# EAGLE design mapleCUx_large_330-007 (EAGLE 7.6.0)
MAPLE-CUx Large Version
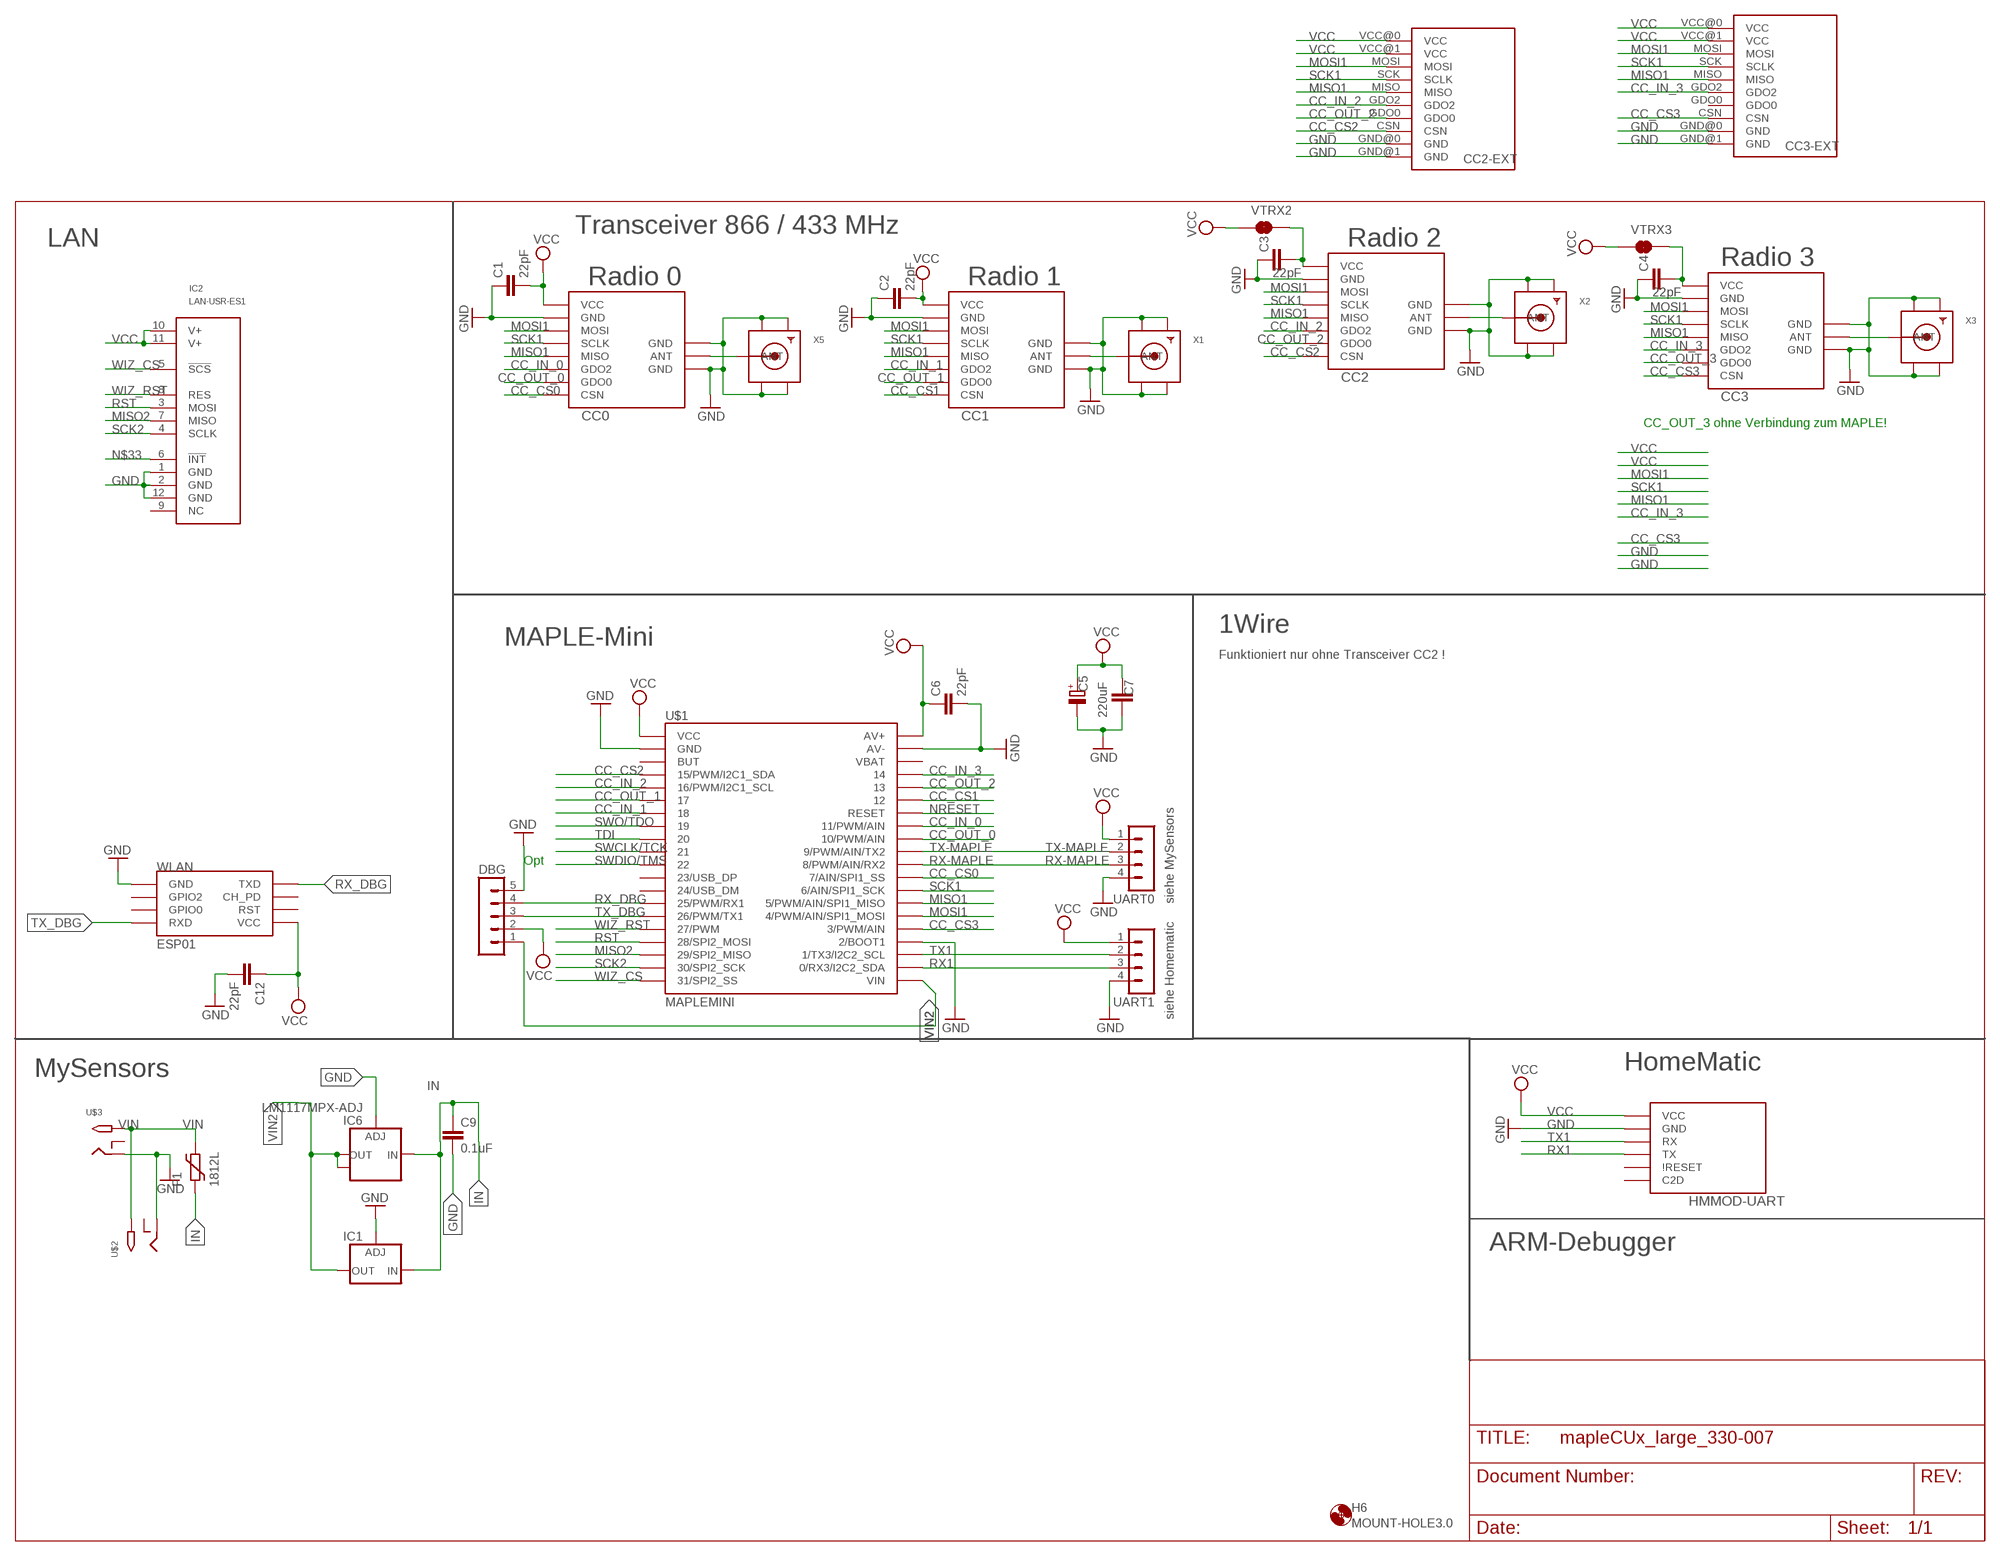
[diagram p0: schematic, sheet 1]

## Parts
C1  22pF  C-EUC0805  [C0805]
C2  22pF  C-EUC0805  [C0805]
C3  22pF  C-EUC0805  [C0805]
C4  22pF  C-EUC0805  [C0805]
C5  220uF  CPOL-EUE5-8.5  [E5-8,5]
C6  22pF  C-EUC0805  [C0805]
C7  C-EUC1812  [C1812]
C9  0.1uF  C-EUC1206  [C1206]
C12  22pF  C-EUC0805  [C0805]
CC0  CC1101  CC1101_MODULE1SMD  [CC1101_MODULE1_SMD]
CC1  CC1101_MODULE1SMD  [CC1101_MODULE1_SMD]
CC2  CC1101_MODULE1SMD  [CC1101_MODULE1_SMD]
CC2-EXT  CC1101_MODULE3_DIL  [CC1101_MODULE3_DIL]
CC3  CC1101_MODULE1SMD  [CC1101_MODULE1_SMD]
CC3-EXT  CC1101_MODULE3_DIL  [CC1101_MODULE3_DIL]
DBG  MA05-1  [MA05-1]
F1  1812L  [1812L]
H6  MOUNT-HOLE3.0  [3,0]
HMMOD-UART  HM-MOD-UARTDIL  [HM-MOD-UART-DIL]
IC1  LD117ADT50TR  [DPACK]
IC2  LAN-USR-ES1  [USR-ES1]
IC6  LM1117MPX-ADJ  [SOT223]
U$1  MAPLEMINI  [20-DIP]
U$2  2.1MMJACKTHM  [PJ-102A]
U$3  2.1MMJACKTHM  [PJ-102A]
UART0  MA04-1  [MA04-1]
UART1  MA04-1  [MA04-1]
VTRX2  JUMPER-SMT_2_NC_TRACE_SILK  [SMT-JUMPER_2_NC_TRACE_SILK]
VTRX3  JUMPER-SMT_2_NC_TRACE_SILK  [SMT-JUMPER_2_NC_TRACE_SILK]
WLAN  ESP01  [ESP01]
X1  SMACONNECTOR_EDGE  [SMA_EDGELAUNCH]
X2  SMACONNECTOR_EDGE  [SMA_EDGELAUNCH]
X3  SMACONNECTOR_EDGE  [SMA_EDGELAUNCH]
X5  SMACONNECTOR_EDGE  [SMA_EDGELAUNCH]

## Nets
ANT0: CC0.ANT X5.P(ANT)
ANT1: CC1.ANT X1.P(ANT)
ANT2: CC2.ANT X2.P(ANT)
ANT3: CC3.ANT X3.P(ANT)
CC_CS0: CC0.CSN U$1.29(7/AIN/SPI1_SS)
CC_CS1: CC1.CSN U$1.35
CC_CS2: CC2-EXT.CSN CC2.CSN U$1.4(15/PWM/I2C1_SDA)
CC_CS3: CC3-EXT.CSN CC3.CSN U$1.25(3/PWM/AIN)
CC_IN_0: CC0.GDO2 U$1.33(11/PWM/AIN)
CC_IN_1: CC1.GDO2 U$1.7
CC_IN_2: CC2-EXT.GDO2 CC2.GDO2 U$1.5(16/PWM/I2C1_SCL)
CC_IN_3: CC3-EXT.GDO2 CC3.GDO2 U$1.37
CC_OUT_0: CC0.GDO0 U$1.32(10/PWM/AIN)
CC_OUT_1: CC1.GDO0 U$1.6
CC_OUT_2: CC2-EXT.GDO0 CC2.GDO0 U$1.36
CC_OUT_3: CC3.GDO0
GND [Power]: C1.1 C2.1 C3.1 C4.1 C5.- C6.2 C7.1 C9.2 C12.2 CC0.GND@0(GND) CC0.GND@1(GND) CC0.GND@2(GND) CC1.GND@0(GND) CC1.GND@1(GND) CC1.GND@2(GND) CC2-EXT.GND@0(GND) CC2-EXT.GND@1(GND) CC2.GND@0(GND) CC2.GND@1(GND) CC2.GND@2(GND) CC3-EXT.GND@0(GND) CC3-EXT.GND@1(GND) CC3.GND@0(GND) CC3.GND@1(GND) CC3.GND@2(GND) DBG.5 HMMOD-UART.2(GND) IC1.1(ADJ) IC2.1(GND) IC2.2(GND) IC2.12(GND) IC6.1(ADJ) U$1.2(GND) U$1.24(2/BOOT1) U$1.39(AV-) U$2.RING U$3.RING UART0.4 UART1.4 WLAN.GND X1.GND@1(GND4) X1.GND@2(GND3) X1.GND@3(GND2) X1.GND@4(GND1) X2.GND@1(GND4) X2.GND@2(GND3) X2.GND@3(GND2) X2.GND@4(GND1) X3.GND@1(GND4) X3.GND@2(GND3) X3.GND@3(GND2) X3.GND@4(GND1) X5.GND@1(GND4) X5.GND@2(GND3) X5.GND@3(GND2) X5.GND@4(GND1)
IN [Power]: C9.1 F1.P$1 IC1.3(IN) IC6.3(IN)
MISO1: CC0.MISO CC1.MISO CC2-EXT.MISO CC2.MISO CC3-EXT.MISO CC3.MISO U$1.27(5/PWM/AIN/SPI1_MISO)
MISO2: IC2.7(MISO) U$1.18(29/SPI2_MISO)
MOSI1: CC0.MOSI CC1.MOSI CC2-EXT.MOSI CC2.MOSI CC3-EXT.MOSI CC3.MOSI U$1.26(4/PWM/AIN/SPI1_MOSI)
N$1 [Power]: C3.2 CC2.VCC VTRX2.2
N$3 [Power]: C4.2 CC3.VCC VTRX3.2
N$33: IC2.6(!INT!)
NRESET: U$1.34(RESET)
RST: IC2.3(MOSI) U$1.17(28/SPI2_MOSI)
RX1: HMMOD-UART.5(TX) U$1.22(0/RX3/I2C2_SDA) UART1.3
RX-MAPLE: U$1.30(8/PWM/AIN/RX2) UART0.3
RX_DBG: DBG.4 U$1.14(25/PWM/RX1) WLAN.TX(TXD)
SCK1: CC0.SCLK CC1.SCLK CC2-EXT.SCK(SCLK) CC2.SCLK CC3-EXT.SCK(SCLK) CC3.SCLK U$1.28(6/AIN/SPI1_SCK)
SCK2: IC2.4(SCLK) U$1.19(30/SPI2_SCK)
SWCLK/TCK: U$1.10
SWDIO/TMS: U$1.11
SWO/TDO: U$1.8
TDI: U$1.9
TX1: HMMOD-UART.6(RX) U$1.23(1/TX3/I2C2_SCL) UART1.2
TX-MAPLE: U$1.31(9/PWM/AIN/TX2) UART0.2
TX_DBG: DBG.3 U$1.15(26/PWM/TX1) WLAN.RX(RXD)
VCC [Power]: C1.2 C2.2 C5.+ C6.1 C7.2 C12.1 CC0.VCC CC1.VCC CC2-EXT.VCC@0(VCC) CC2-EXT.VCC@1(VCC) CC3-EXT.VCC@0(VCC) CC3-EXT.VCC@1(VCC) DBG.2 HMMOD-UART.1(VCC) IC2.10(V+) IC2.11(V+) U$1.1(VCC) U$1.40(AV+) UART0.1 UART1.1 VTRX2.1 VTRX3.1 WLAN.VCC
VIN [Power]: F1.P$2 U$2.TIP U$3.TIP
VIN2 [Power]: DBG.1 IC1.4(OUT) IC6.2(OUT) IC6.TAB(OUT1) U$1.21(VIN)
WIZ_CS: IC2.5(!SCS!) U$1.20(31/SPI2_SS)
WIZ_RST: IC2.8(RES) U$1.16(27/PWM)
Unconnected: CC3-EXT.GDO0 HMMOD-UART.3(C2D) HMMOD-UART.4(\!RESET) IC2.9(NC) U$1.3(BUT) U$1.12(23/USB_DP) U$1.13(24/USB_DM) U$1.38(VBAT) U$2.RING_SW U$3.RING_SW WLAN.CH_PD WLAN.GPIO0 WLAN.GPIO2 WLAN.RST

## Notes on the sheet
- Transceiver 866 / 433 MHz
- LAN | Radio 2
- Radio 3
- Radio 0 | Radio 1
- CC_OUT_3 ohne Verbindung zum MAPLE!
- 1Wire
- MAPLE-Mini
- Funktioniert nur ohne Transceiver CC2 !
- Opt
- siehe MySensors
- siehe Homematic
- MySensors | HomeMatic
- ARM-Debugger

## Library data of the parts
C1-C4 C6 C7 C9 C12 = rcl:C-EU: CAPACITOR, European symbol
C5 = rcl:CPOL-EU: POLARIZED CAPACITOR, European symbol
CC0 CC1-CC3 = wireless:CC1101_MODULE1: CC1101 wireless module for 433/868 MHz (sold from Aliexpress). DIL version for mounting with pin header (and SMD soldering) and SMD only variant available.
CC2-EXT CC3-EXT = wireless:CC1101_MODULE3_DIL: 433 Mhz CC1101 wireless module named RF1101SE V3.1 package special has only limited silk screen on tPlace layer
DBG = con-lstb:MA05-1: PIN HEADER; OC_FARNELL: unknown; OC_NEWARK: unknown
F1 = ptc-littlefuse:1812L
H6 = holes:MOUNT-HOLE: MOUNTING HOLE with drill center marker
HMMOD-UART = wireless:HM-MOD-UART: eQ3 HM-MOD-UART-AW-SH2 wireless module for 868 MHz. DIL version for mounting with pin header (antenna upwards) and SMD variant available (antenna downwards).
IC1 = v-reg:LD117A?*: Low drop fixed and adjustable positive voltage regulators 1 A Source: http://www.st.com/stonline/products/literature/ds/7194/ld1117axx.pdf
IC2 = Martin-Communication:LAN-USR-ES1
IC6 = lm1117:LM1117MPX-ADJ
U$1 = maplemini-small:MAPLEMINI
U$2 U$3 = adafruit:2.1MMJACK: 2.1mm x 5.5mm THM DC jack with internal switch. Digikey part #PJ-102A, 4UCON part #05537 2.1mm x 5.5mm SMT DC jack with internal switch. Digikey part #PJ-002A-SMT, 4UCON part #03267 By microbuilder.eu & adafruit.com
UART0 UART1 = con-lstb:MA04-1: PIN HEADER; OC_FARNELL: unknown; OC_NEWARK: unknown
VTRX2 VTRX3 = SparkFun-Jumpers:JUMPER-SMT_2_NC_TRACE: Normally closed trace jumper This jumper has a trace between two pads so it's normally closed (NC). Use a razor knife to open the connection. For best results follow the IPC guidelines for cutting traces: Cutout at least 0.063 mm (0.005 in). Remove all loose material to clean up the cut area. Seal the cut with an approved epoxy. Reapply solder to reclose the connection.
WLAN = esp8266modules:ESP01: ESP8266 Wifi module 01
X1-X3 X5 = adafruit:SMACONNECTOR: SMA Connector 90° DIP SMA Connector, 50 Ohm (4UConnector: 07259)

## Net classes
0 default: width 0.305 mm
1 Power: width 0.61 mm

## Board
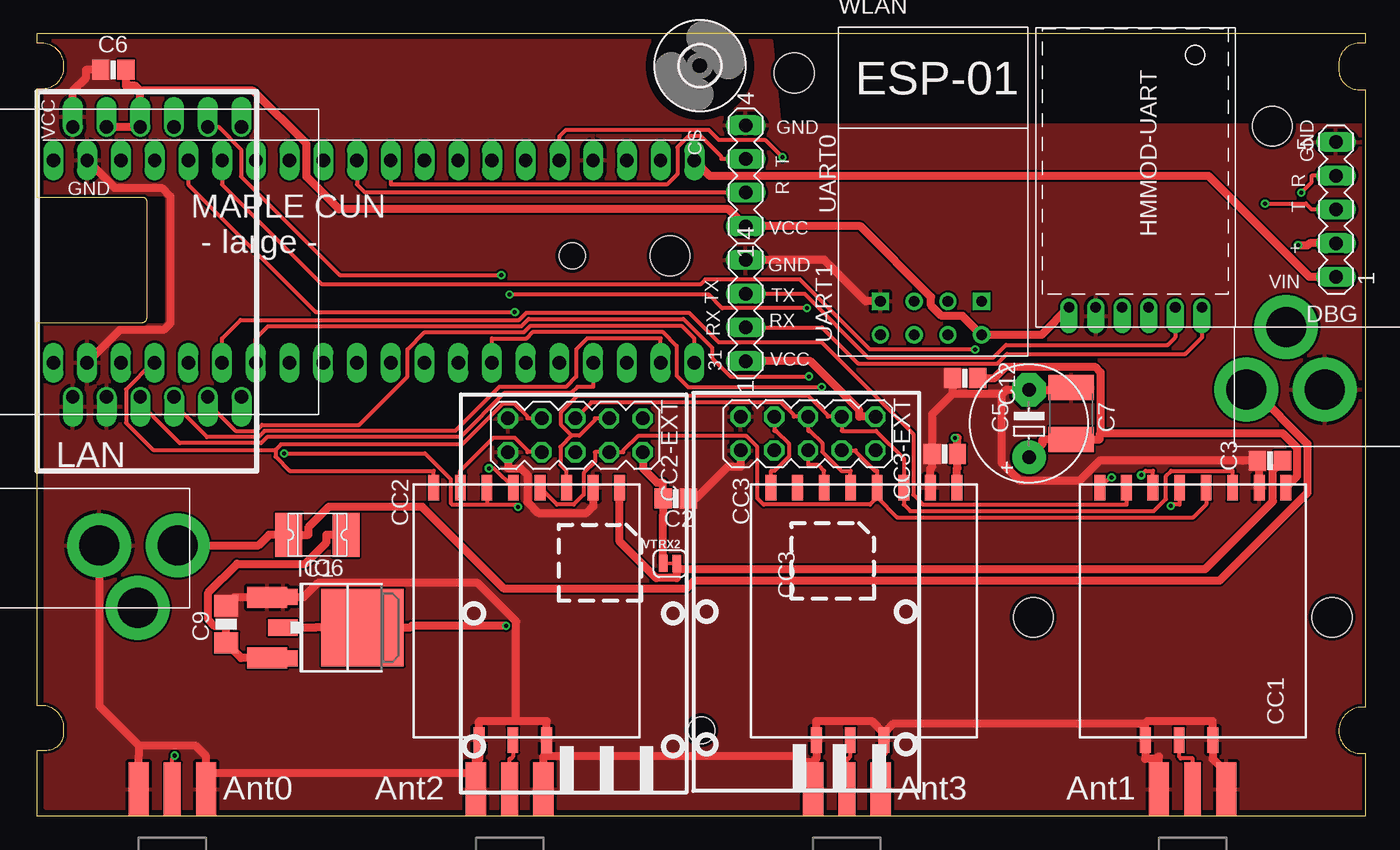
[diagram p1: board, top side]
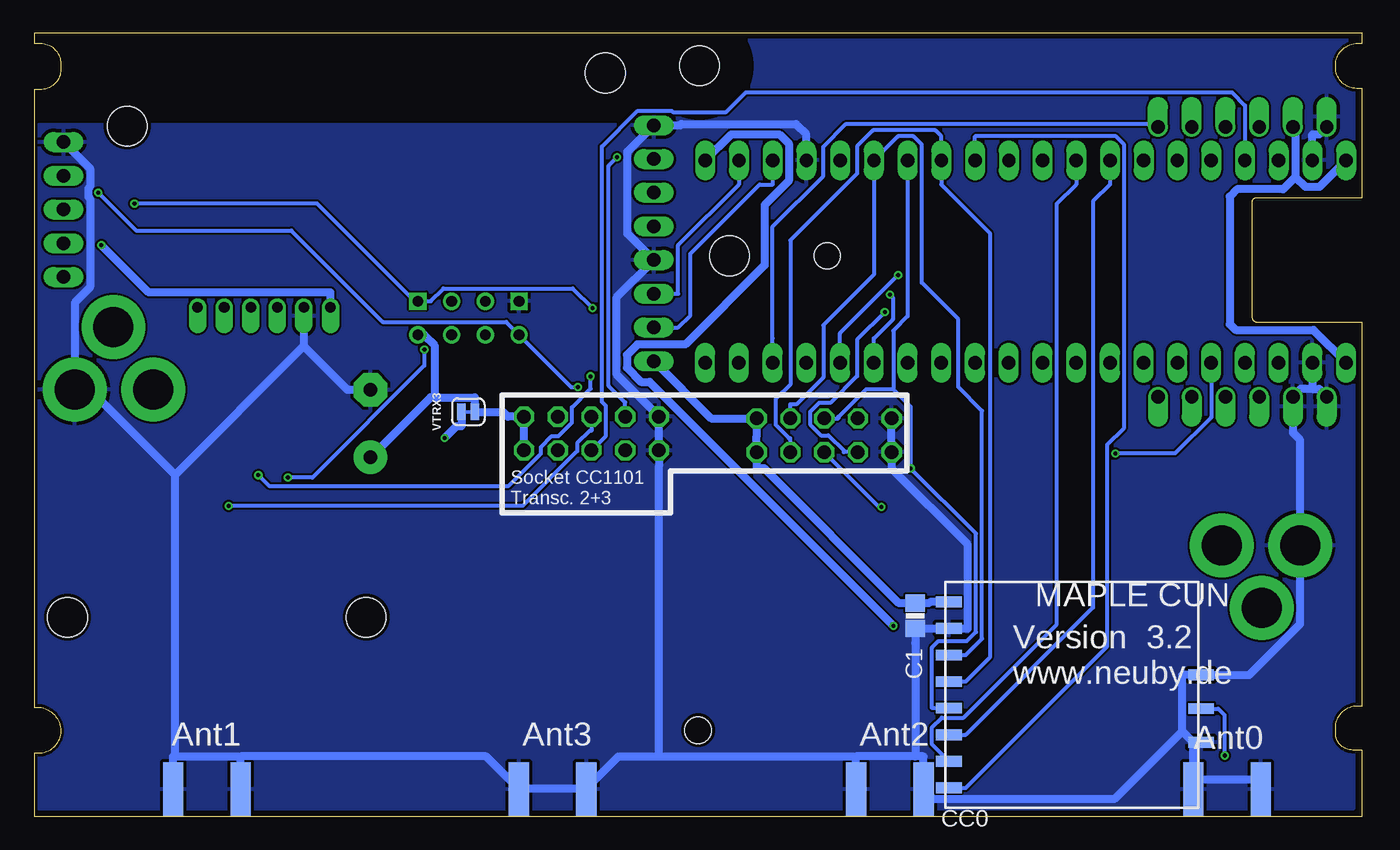
[diagram p2: board, bottom side, seen from below]

Size 100 x 59 mm. Coordinates in mm from the lower left corner, seen from the top.
Outline: 0,0 0,5 0.71,5 arc90 2,6.29 2,6.67 arc90 0.32,8.35 0,8.35 0,37.21 7.89,37.21 arc90 8.26,37.58 8.26,46.32 arc90 7.97,46.61 0,46.61 0,54.83 0.39,54.83 arc90 2,56.44 2,56.57 arc90 0.33,58.24 0,58.24 0,59 100,59 100,58.24 99.54,58.24 arc90 98,56.7 98,56.41 arc90 99.41,54.75 100,54.75 100,8.24 99.8,8.24 arc90 98,6.44 arc90 99.69,4.75 100,4.75 100,0 0,0
Copper layers (1*16): Top 0.035mm / dielectric 1.5mm / Bottom 0.035mm
Design rules "SeeedStudio_2layer_DRU_no_angle_20140221": minimum track width 6mil, minimum drill 12mil, track to track 6mil, track to pad 6mil, pad to pad 6mil, via to via 6mil, smd to smd 0mil, copper to edge 10mil, drill to drill 10mil, minimum pad ring 10mil, minimum via ring 6mil, stop-mask expansion 2mil, vias tented up to drill 100mil, thermal gap 10mil
Holes 2 mm at 50,6.5 40.28,42.23
Holes 3 mm at 47.65,42.23 93,52 57,56 75,15 97.5,15
tRestrict: area 0,37.3 to 9.4,46.5
bRestrict: area 0,37.3 to 9.4,46.5

### Footprints (pad centres in the part's own frame; a part is rotated, then mirrored left to right if it is on the bottom)
C0805 = smd 1.3 x 1.5: 1 -0.95,0; 2 0.95,0
E5-8,5 = drill 1.016 pad 2.54: + -2.54,0 | drill 1.016 pad 2.54 octagon: - 2.54,0
C1812 = smd 1.9 x 3.4: 1 -1.95,0; 2 1.95,0
C1206 = smd 1.6 x 1.8: 1 -1.4,0; 2 1.4,0
CC1101_MODULE1_SMD = smd 1.93 x 0.813: ANT 19,5.96; CSN 0,0; GDO0 0,2; GDO2 0,4; GND@0 0,12; GND@1 19,8.5; GND@2 19,3.42; MISO 0,6; MOSI 0,10; SCLK 0,8; VCC 0,14
CC1101_MODULE3_DIL = drill 1.016 octagon: CSN 1.81,6.1; GDO0 4.35,6.1; GDO2 4.35,8.64; GND@0 1.81,3.56; GND@1 4.35,3.56; MISO 1.81,8.64; MOSI 1.81,11.18; SCK 4.35,11.18; VCC@0 1.81,13.72; VCC@1 4.35,13.72
MA05-1 = drill 1.016 long: 1 -5.08,0; 2 -2.54,0; 3 0,0; 4 2.54,0; 5 5.08,0
1812L = smd 2.03 x 3.3: P$1 -2.16,0; P$2 2.16,0
3,0 = hole 3: 0,0
HM-MOD-UART-DIL = drill 0.8 offset: 1 0,12; 2 0,10; 3 0,8; 4 0,6; 5 0,4; 6 0,2
DPACK = smd 1.6 x 3: 1 -2.28,-4.8; 3 2.28,-4.8 | smd 5.8 x 6.2: 4 0,2.38
USR-ES1 = drill 1 pad 1.35 offset: 1 -10.16,5.715; 2 -10.16,3.175; 3 -10.16,0.635; 4 -10.16,-1.905; 5 -10.16,-4.445; 6 -10.16,-6.985; 7 10.16,-6.985; 8 10.16,-4.445; 9 10.16,-1.905; 10 10.16,0.635; 11 10.16,3.175; 12 10.16,5.715
SOT223 = smd 1.219 x 2.235: 1 -2.311,-3.099; 2 0,-3.099; 3 2.311,-3.099 | smd 3.6 x 2.2: TAB 0,3.099
20-DIP = drill 1.016 pad 1.27 long: 1 -24.13,-7.62; 2 -21.59,-7.62; 3 -19.05,-7.62; 4 -16.51,-7.62; 5 -13.97,-7.62; 6 -11.43,-7.62; 7 -8.89,-7.62; 8 -6.35,-7.62; 9 -3.81,-7.62; 10 -1.27,-7.62; 11 1.27,-7.62; 12 3.81,-7.62; 13 6.35,-7.62; 14 8.89,-7.62; 15 11.43,-7.62; 16 13.97,-7.62; 17 16.51,-7.62; 18 19.05,-7.62; 19 21.59,-7.62; 20 24.13,-7.62 | drill 1 pad 1.27 long: 21 24.13,7.62; 22 21.59,7.62; 23 19.05,7.62; 24 16.51,7.62; 25 13.97,7.62; 26 11.43,7.62; 27 8.89,7.62; 28 6.35,7.62; 29 3.81,7.62; 30 1.27,7.62; 31 -1.27,7.62; 32 -3.81,7.62; 33 -6.35,7.62; 34 -8.89,7.62; 35 -11.43,7.62; 36 -13.97,7.62; 37 -16.51,7.62; 38 -19.05,7.62; 39 -21.59,7.62; 40 -24.13,7.62
PJ-102A = drill 3 pad 4.8: RING 0.1,-3.39; RING_SW -4.6,-6.29; TIP 0.1,-9.29
MA04-1 = drill 1.016 long: 1 -3.81,0; 2 -1.27,0; 3 1.27,0; 4 3.81,0
SMT-JUMPER_2_NC_TRACE_SILK = smd 0.635 x 1.27: 1 -0.508,0; 2 0.508,0
ESP01 = drill 0.8: CH_PD -1.285,-8.178; GPIO0 1.255,-5.638; GPIO2 -1.285,-5.638; RST 1.255,-8.178; TX -3.825,-8.178; VCC 3.795,-8.178 | drill 0.8 square: GND -3.825,-5.638; RX 3.795,-5.638
SMA_EDGELAUNCH = smd 4.064 x 1.524: GND@1 2.032,-2.54; GND@2 2.032,2.54 | smd 4.064 x 1.524 bottom: GND@3 2.032,2.54; GND@4 2.032,-2.54 | smd 4.064 x 1.27: P 2.032,0

### Placement (x,y rotation side)
C1  33.66,15.11 90 bottom
C2  48.08,23.95 180 top
C3  92.82,26.8 0 top
C4  68.33,27.3 0 top
C5  74.68,29.59 90 top
C6  5.71,56.24 180 top
C7  77.85,30.35 270 top
C9  14.22,14.48 90 top
C12  69.85,33.02 180 top
CC0  31.11,2.16 0 bottom
CC1  80.01,24.77 270 top
CC2  29.84,24.77 270 top
CC2-EXT  31.87,31.79 270 top
CC3  55.24,24.77 270 top
CC3-EXT  49.4,31.93 270 top
DBG  97.79,45.72 90 top
F1  21.08,21.21 180 top
H6  49.89,56.55 0 top
HMMOD-UART  89.69,38.35 90 top
IC1  22.1,14.22 270 top
IC2  8.38,41.78 90 top
IC6  21.59,14.22 270 top
U$1  25.34,41.8 0 top
U$2  1.27,20.32 90 top
U$3  100.33,32.26 270 top
UART0  53.34,48.26 90 top
UART1  53.34,38.1 90 top
VTRX2  47.62,19.05 0 top
VTRX3  67.31,30.48 180 bottom
WLAN  67.31,44.45 0 top
X1  87,0 90 top
X2  35.56,0 90 top
X3  60.96,0 90 top
X5  10.16,0 90 top

### Tracks (layer width: path | path; a pad name or v marks a point on that pad's centre or on a via)
ANT0  (via drill 0.3 pad 0.61)
  Top 0.305: X5.P 10.16,4.37 10.35,4.55 v10.35,4.59
  Bottom 0.305: CC0.ANT 10.85,8.12 10.35,7.62 v10.35,4.59
ANT1
  Top 0.305: X1.P 87,4.37 86.1,4.37 85.97,4.5 CC1.ANT
ANT2
  Top 0.305: X2.P 35.56,4.37 35.68,4.37 35.8,4.5 CC2.ANT
ANT3
  Top 0.305: X3.P 60.96,4.37 61.08,4.37 61.2,4.5 CC3.ANT
CC_CS0
  Bottom 0.305: CC0.CSN 29.84,2.16 19.18,12.82 19.18,28 17.91,29.28 17.91,50.6 18.54,51.23 29.15,51.23 U$1.29
CC_CS1  (via drill 0.3 pad 0.61)
  Top 0.305: v70.62,35.18 62.68,35.18 57.42,40.44 50.3,40.44 49.93,40.07 21.44,40.07 13.91,47.61 U$1.35 | v80.89,25.53 80.78,25.53 CC1.CSN
  Bottom 0.305: v70.62,35.18 70.62,33.96 79.04,25.53 v80.89,25.53
CC_CS2
  Top 0.305: 17.94,27.62 17.94,27.1 19,26.04 29.84,26.04 CC2.CSN | 17.94,27.62 18.34,28.02 31.96,28.02 35.02,31.08 35.93,31.08 36.9,30.11 36.9,29.98 CC2-EXT.CSN | U$1.4 8.69,34.18 6.67,32.16 6.67,29.65 8.71,27.62 17.94,27.62
CC_CS3  (via drill 0.3 pad 0.61)
  Top 0.305: CC3.CSN 55.24,26.04 55.51,26.04 56.59,27.11 56.59,28.09 55.63,29.05 55.49,29.05 CC3-EXT.CSN | U$1.25 39.31,51.23 39.8,51.73 50.54,51.73 51.3,50.96 54.79,50.96 v56.1,49.66
  Bottom 0.305: CC3-EXT.CSN 55.49,31.18 56.74,32.43 56.74,49.01 v56.1,49.66
CC_IN_0
  Bottom 0.305: CC0.GDO2 29.84,6.16 20.26,15.75 20.26,46.34 18.99,47.61 U$1.33
CC_IN_1  (via drill 0.3 pad 0.61)
  Top 0.305: v58.1,33.15 52.18,33.15 50.8,34.53 50.8,35.32 48.65,37.47 36.99,37.47 36.46,36.94 17.38,36.94 16.45,36.01 U$1.7 | v83.12,25.71 83.45,26.04 84.01,26.04 CC1.GDO2
  Bottom 0.305: v83.12,25.71 82.31,24.9 64.27,24.9 61.84,27.33 61.84,27.83 61.03,28.64 60.53,28.64 59.51,29.66 59.51,30.81 58.1,32.22 v58.1,33.15
CC_IN_2  (via drill 0.3 pad 0.61)
  Top 0.305: v18.57,27.34 29.19,27.34 31.13,25.4 31.13,23.61 31.25,23.5 33.84,23.5 | 33.84,23.5 36.01,23.5 v36.18,23.32 | CC2.GDO2 33.84,23.5
  Bottom 0.305: U$1.5 11.37,30.07 14.09,27.34 v18.57,27.34 | CC2-EXT.GDO2 36.39,23.32 v36.18,23.32
CC_IN_3
  Top 0.305: CC3-EXT.GDO2 58.03,26.51 58.77,26.51 59.24,26.04 CC3.GDO2
  Bottom 0.305: CC3-EXT.GDO2 56.95,28.66 56.95,30.93 57.24,31.23 57.24,50.47 54.56,53.15 52,53.15 51.9,53.06 47.89,53.06 46.41,54.54 9.81,54.54 8.83,53.56 U$1.37
CC_OUT_0
  Bottom 0.305: CC0.GDO0 32.38,5.43 32.38,6.72 31.66,7.45 30.02,7.45 22.99,14.48 22.99,46.15 21.53,47.61 U$1.32
CC_OUT_1
  Top 0.305: CC1.GDO0 82.01,23.5 66.7,23.5 65.96,24.24 65.96,28.79 59.03,35.72 51.31,35.72 49.07,37.95 36.83,37.95 36.27,37.39 15.29,37.39 13.91,36.01 U$1.6
CC_OUT_2  (via drill 0.3 pad 0.61)
  Top 0.305: CC2.GDO0 31.84,26.04 34.33,28.52 35.95,28.52 36.9,27.57 36.9,27.44 CC2-EXT.GDO0 | U$1.36 11.37,47.61 20.97,38 v35.95,38
  Bottom 0.305: CC2-EXT.GDO0 39.04,27.44 39.04,27.55 40.2,28.71 40.76,28.71 41.58,29.53 41.58,30.47 40.9,31.16 40.05,31.16 38.04,33.17 38.04,35.92 v35.95,38
GND
  Top 0.61: 68.9,31.81 67.38,30.3 C4.1 67.38,26.33 67.25,26.19 CC3.GND@0 | 72.63,31.81 72.95,32.13 C5.- 76.4,32.13 76.58,32.3 C7.1 | 72.63,31.81 72.63,26.64 74,25.27 78.47,25.27 80,26.8 90.76,26.8 C3.1 91.87,26.33 92.01,26.19 CC1.GND@0 | 72.63,31.81 68.9,31.81 | C12.2 68.9,31.81 | CC2.GND@0 41.84,23.34 41.38,22.88 37.71,22.88 36.9,23.69 36.9,25.74 36.42,26.22 35.43,26.22 CC2-EXT.GND@1 | 36.05,7.19 36.05,14.69 33.16,17.58 21.11,17.58 20.07,16.54 19.28,16.54 | 36.05,7.19 33.27,7.19 CC2.GND@2 33.27,4.34 33.03,4.34 33.02,4.33 33.02,3.28 | 36.05,7.19 38.34,7.19 CC2.GND@1 38.34,4.77 38.1,4.52 | WLAN.GND 62.37,38.81 59.28,41.91 UART1.4 | 83.43,7 83.62,7.19 88.51,7.19 CC1.GND@1 88.51,4.34 89.53,3.32 X1.GND@4 | 58.42,4.1 58.66,4.34 CC3.GND@2 58.66,7.19 62.83,7.19 63.74,6.27 | X3.GND@3 58.42,4.1 | 58.42,4.1 57.39,4.1 56.96,4.52 38.1,4.52 | X2.GND@1 38.1,4.52 | C6.2 3.66,56.24 3.66,55.65 2.67,54.66 IC2.12 | 7.62,5.36 7.62,4.52 X5.GND@3 | U$2.RING 4.66,8.32 7.62,5.36 | 7.62,5.36 11.86,5.36 12.7,4.52 12.7,3.28 | X2.GND@3 33.02,3.28 | X5.GND@4 12.7,3.28 | 12.7,3.28 33.02,3.28 | X3.GND@4 63.5,4.52 63.74,4.77 CC3.GND@1 63.74,6.02 63.74,6.27 | 19.28,16.54 19.25,16.51 19.25,16.5 IC1.1 15.34,16.5 14.85,16.5 C9.2 | IC6.1 19.28,16.54 | CC3-EXT.GND@1 52.95,26.36 51.99,26.36 49.58,23.95 C2.1 | U$1.39 5.81,47.35 9.35,47.35 10.01,46.7 10.01,37.14 9.51,36.64 6.21,36.64 U$1.2 | 63.74,6.27 64.47,7 83.43,7 | 83.43,7 CC1.GND@2 83.43,4.34 84.28,4.34 84.45,4.52 X1.GND@3
  Bottom 0.61: U$1.39 3.75,51.38 3.23,51.38 IC2.12 | 89.38,4.52 84.45,4.52 | 89.38,4.52 89.53,4.52 X1.GND@4 | 89.38,4.52 89.38,25.73 | 89.38,25.73 79.69,35.42 | 89.38,25.73 95.81,32.16 U$3.RING 96.94,38.7 95.79,39.86 95.79,46.53 95.93,46.67 95.93,47.3 95.79,47.45 95.79,48.8 DBG.5 | X1.GND@3 84.45,4.52 | 63.5,2.05 65.97,4.52 84.45,4.52 | 63.5,2.05 63.5,2.07 58.42,2.07 | X3.GND@4 63.5,2.05 | CC2-EXT.GND@0 CC2-EXT.GND@1 35.43,26.22 29.69,20.48 29.69,14.16 CC0.GND@0 32.44,14.16 32.45,14.16 C1.1 33.66,13.06 33.66,4.52 | 58.42,2.07 58.42,2.11 56.01,4.52 52.95,4.52 | X3.GND@3 58.42,2.07 | 52.95,4.52 38.1,4.52 | 52.95,4.52 52.95,26.36 CC3-EXT.GND@1 CC3-EXT.GND@0 56.13,33.29 56.13,39.12 UART1.4 55.32,43.89 55.32,50.09 UART0.4 51.36,52.07 51.27,52.16 42.62,52.16 41.85,51.38 U$1.24 | X2.GND@1 38.1,4.52 | 33.66,4.52 38.1,4.52 | 33.66,4.52 33.02,4.52 X2.GND@3 32.28,1.29 18.66,1.29 13.54,6.42 | 13.54,6.42 13.54,10.66 CC0.GND@1 8.5,10.66 4.66,14.5 U$2.RING 4.66,28.36 5.21,28.9 IC2.2 4.63,32.2 3.75,32.2 | 12.7,5.58 13.54,6.42 | 12.7,2.78 12.7,5.58 | X5.GND@4 12.7,2.78 | 12.7,2.78 7.62,2.78 X5.GND@3 | 79.69,35.42 76.4,32.13 C5.- | 79.69,35.42 79.69,36.12 HMMOD-UART.2 | 3.75,32.2 3.75,32.39 U$1.2 | 3.75,32.2 3.24,32.2 IC2.1 | CC0.GND@2 12.7,5.58
  pour Bottom: 0.64,0.64 0.64,58.42 55.24,58.42 55.88,52.07 99.69,52.07 99.69,0.64
  pour Top: 0.64,0.64 0.64,58.42 55.24,58.42 55.88,52.07 99.69,52.07 99.69,0.64
IN
  Top 0.61: IC6.3 18.46,11.94 IC1.3 15.34,11.94 15.34,11.96 C9.1 14.22,14.34 13.36,14.34 12.87,14.83 12.87,16.87 15.03,19.04 20.15,19.04 21.77,20.66 21.77,21.21 F1.P$1
MISO1  (via drill 0.3 pad 0.61)
  Top 0.305: v34,26.23 34.38,26.23 CC2.MISO | CC2-EXT.MISO 41.71,31.18 56.01,31.18 56.97,30.23 56.97,30.11 CC3-EXT.MISO 58.03,29.05 58.17,29.05 59.1,28.11 59.1,27.47 60.53,26.04 61.24,26.04 CC3.MISO | v85.35,23.4 85.44,23.5 86.01,23.5 CC1.MISO
  Bottom 0.305: 35.31,32.18 34,30.87 v34,26.23 29.08,21.31 29.08,13.9 29.77,13.21 31.9,13.21 32.38,12.72 32.38,8.16 CC0.MISO | 35.31,32.18 37.36,32.18 39.44,30.09 39.44,29.98 CC2-EXT.MISO | 35.31,32.18 35.31,36.6 34.23,37.68 34.23,47.61 U$1.27 | v85.35,23.4 63.22,23.4 59.1,27.51 59.1,28.11 58.17,29.05 58.03,29.05 CC3-EXT.MISO
MISO2
  Bottom 0.305: IC2.7 15.59,52.17 38.85,52.17 40.58,50.44 40.58,48.24 44.39,44.43 44.39,36.01 U$1.18
MOSI1
  Top 0.305: 40.23,28.68 39.39,27.84 39.39,26.49 39.84,26.04 CC2.MOSI | 40.23,28.68 40.82,28.68 41.98,29.85 41.98,29.98 CC2-EXT.MOSI | 40.23,28.68 39.44,29.47 39.44,30.46 40.67,31.7 58.04,31.7 59.51,30.23 59.51,30.11 CC3-EXT.MOSI 60.58,29.05 63.16,29.05 65.25,26.96 CC3.MOSI 65.25,23.5 65.73,23.01 84.07,23.01 84.98,23.91 84.98,25.64 85.38,26.04 90.01,26.04 CC1.MOSI
  Bottom 0.305: CC2-EXT.MOSI 43.05,31.05 42.61,31.05 40.58,33.08 40.58,37 36.77,40.81 U$1.26 34.95,51.23 33.79,51.23 33.16,50.6 33.16,40.2 30.42,37.45 30.42,32.35 28.62,30.55 28.62,13.39 29.84,12.16 CC0.MOSI
N$1
  Top 0.61: CC2.VCC 43.84,20.7 46.59,17.96 48.13,17.96 48.13,18.63 | 48.13,18.63 87.94,18.63 93.04,23.73 93.04,26.07 C3.2 | VTRX2.2 48.13,18.63
N$3  (via drill 0.3 pad 0.61)
  Top 0.61: v69.09,28.51 69.28,28.51 C4.2 69.28,26.23 69.25,26.19 CC3.VCC
  Bottom 0.61: VTRX3.2 67.82,29.39 68.22,29.39 v69.09,28.51
RST
  Top 0.305: IC2.3 7.75,31.1 10.72,28.12 16.84,28.12 17.3,28.58 31.86,28.58 35.16,31.88 40.2,31.88 40.66,32.35 41.85,32.35 U$1.17
RX1
  Top 0.305: UART1.3 55.17,39.37 57.77,39.37 62.56,34.58 72,34.58 72.94,35.51 85.12,35.51 85.69,36.09 HMMOD-UART.5
  Bottom 0.305: U$1.22 46.93,47.61 51.51,43.02 51.51,39.37 UART1.3
RX-MAPLE
  Top 0.305: U$1.30 26.61,47.61 47.41,47.61 48.2,48.39 48.2,50.41 49.02,51.23 49.97,51.23 51.51,49.69 51.51,49.53 UART0.3
RX_DBG  (via drill 0.3 pad 0.61)
  Top 0.305: v59.06,32.35 49,32.35 48.14,33.21 48.14,35.45 47.07,36.52 37.33,36.52 36.82,36.01 34.23,36.01 U$1.14 | DBG.4 95.96,48.26 95.96,47.78 v95.17,46.99
  Bottom 0.305: v59.06,32.35 59.56,32.35 WLAN.TX 64.46,37.25 73.75,37.25 80.64,44.14 92.32,44.14 v95.17,46.99
SCK1
  Top 0.305: 63.24,24.03 62.71,23.49 54.69,23.49 54.23,23.96 54.23,27.83 53.4,28.66 45.22,28.66 44.12,27.55 44.12,27.44 CC2-EXT.SCK 41.98,27.44 41.98,26.71 41.13,25.86 41.13,24.24 40.39,23.5 39.12,23.5 CC2.SCLK | 63.24,24.03 64.74,22.53 87.05,22.53 88.01,23.5 CC1.SCLK | 63.24,24.03 63.24,24.56 CC3.SCLK 63.24,26.04 63.07,26.04 61.64,27.46 61.64,27.57 CC3-EXT.SCK
  Bottom 0.305: CC2-EXT.SCK 43.05,28.51 43.16,28.51 44.16,29.51 44.16,31.43 43.06,32.52 43.06,43.4 38.04,48.43 38.04,50.48 36.83,51.69 32.15,51.69 31.69,51.23 U$1.28 31.69,48.51 31.69,47.61 28.03,43.95 28.03,11.97 29.84,10.16 CC0.SCLK
SCK2
  Top 0.305: IC2.4 10.29,31.07 12.77,28.58 16.65,28.58 17.11,29.04 31.46,29.04 34.77,32.35 39.8,32.35 40.58,33.12 40.58,35.19 41.4,36.01 46.93,36.01 U$1.19
TX1
  Top 0.305: HMMOD-UART.6 87.69,36.09 86.44,34.84 73.02,34.84 72.3,34.12 61.8,34.12 59.09,36.83 55.17,36.83 UART1.2
  Bottom 0.305: U$1.23 44.39,47.61 45.37,47.61 50.59,42.38 50.59,37.75 51.51,36.83 UART1.2
TX-MAPLE
  Top 0.305: U$1.31 24.07,47.61 24.68,46.99 UART0.2
TX_DBG  (via drill 0.3 pad 0.61)
  Top 0.305: v57.95,38.28 51.57,38.28 50.56,39.3 v35.56,39.3 | DBG.3 95.96,45.72 95.52,46.16 v92.45,46.16
  Bottom 0.305: v35.56,39.3 35.34,39.08 35.34,37.43 36.77,36.01 U$1.15 | v57.95,38.28 59.44,39.77 69.18,39.77 70.15,38.81 WLAN.RX 71.22,38.81 71.34,38.81 78.69,46.16 v92.45,46.16
VCC  (via drill 0.3 pad 0.61)
  Top 0.61: DBG.2 95.81,43.18 95.66,43.03 v94.94,43.03 | C5.+ 75.69,28.07 75.69,28.4 C7.2 80.01,28.4 80.01,28.81 80.05,28.85 | HMMOD-UART.1 75.61,36.27 WLAN.VCC 69.68,37.7 68.09,37.7 67.3,38.5 67.3,39.14 61.98,44.45 UART0.1 52.06,45.73 22.71,45.73 20.26,48.19 20.26,50.66 16.25,54.66 7.75,54.66 | UART1.1 58.21,34.29 61.9,30.61 61.9,30.11 CC3-EXT.VCC@0 | 80.05,28.85 80.05,33.44 79.62,33.87 72.92,33.87 72.07,33.02 71.91,33.02 C12.1 | VTRX2.1 47.12,22.73 47.12,22.74 C2.2 47.12,25.15 46.66,25.15 45.59,26.22 CC2-EXT.VCC@1 | CC1.VCC 94.88,25.63 94.88,27.74 93.77,28.85 80.05,28.85 | IC2.11 IC2.10 7.75,54.66 | 7.75,54.66 7.37,55.04 6.67,55.04 C6.1
  Bottom 0.61: HMMOD-UART.1 77.69,39.47 91.37,39.47 v94.94,43.03 | UART1.1 49.03,29.98 CC2-EXT.VCC@0 45.59,28.66 CC2-EXT.VCC@1 45.59,26.22 45.02,26.22 34.86,16.06 C1.2 32.63,16.06 32.54,16.16 CC0.VCC | 69.86,31.57 66.8,31.57 VTRX3.1 64.7,30.48 64.33,30.11 CC3-EXT.VCC@0 CC3-EXT.VCC@1 | C5.+ 70.16,31.57 69.86,31.57 | WLAN.VCC 70.63,36.27 69.86,35.5 69.86,31.57 | 5.02,48.17 4.27,47.43 3.2,47.43 U$1.40 | IC2.11 5.02,51.75 5.02,48.17 | 5.02,48.17 5.94,47.25 9.43,47.25 9.97,46.71 9.97,37.09 9.52,36.64 3.67,36.64 U$1.1
VIN
  Top 0.61: U$3.TIP 91.55,32.16 95.65,28.06 95.65,24.37 89.02,17.75 49.44,17.75 48.84,17.15 35.15,17.15 28.98,23.32 21.95,23.32 20.39,21.76 20.39,21.21 F1.P$2 17.45,21.21 16.66,20.42 U$2.TIP
VIN2  (via drill 0.3 pad 0.61)
  Top 0.61: IC1.4 28.04,14.22 28.18,14.37 v35.29,14.37 | U$1.21 50.63,48.26 88.19,48.26 95.81,40.64 DBG.1 | IC6.2 20.92,14.22 IC1.4 | IC1.4 IC6.TAB
  Bottom 0.61: U$1.21 47.5,51.39 43.88,51.39 43.17,50.68 43.17,47.88 45,46.06 45,41.52 50.96,35.56 54.58,35.56 55.37,34.77 55.37,33.81 54.3,32.74 53.66,32.74 v35.29,14.37
WIZ_CS
  Top 0.305: IC2.5 12.83,31.14 14.93,29.05 16.47,29.05 16.92,29.49 24.22,29.49 27.88,33.15 27.88,35.19 29.17,36.48 36.65,36.48 37.14,36.97 48.5,36.97 49.47,36.01 U$1.20
WIZ_RST  (via drill 0.3 pad 0.61)
  Top 0.305: IC2.8 13.64,51.94 15.34,50.24 15.34,48.21 22.77,40.78 v34.94,40.78
  Bottom 0.305: U$1.16 39.31,36.41 v34.94,40.78

### Text on the board
tNames: CS | VCC | GND | T | GND | GND | R | R | VCC | T | + | MAPLE CUN / - large - | GND | VIN | TX | TX | RX | RX | 31 | VCC | LAN | CC3 | Ant0 | Ant2 | Ant3 | Ant1
bNames: Socket CC1101 / Transc. 2+3 | MAPLE CUN | Version 3.2 / www.neuby.de | Ant0 | Ant2 | Ant3 | Ant1